# EAGLE design SparkFun_Qwiic_ADXL313 (EAGLE 9.6.2)
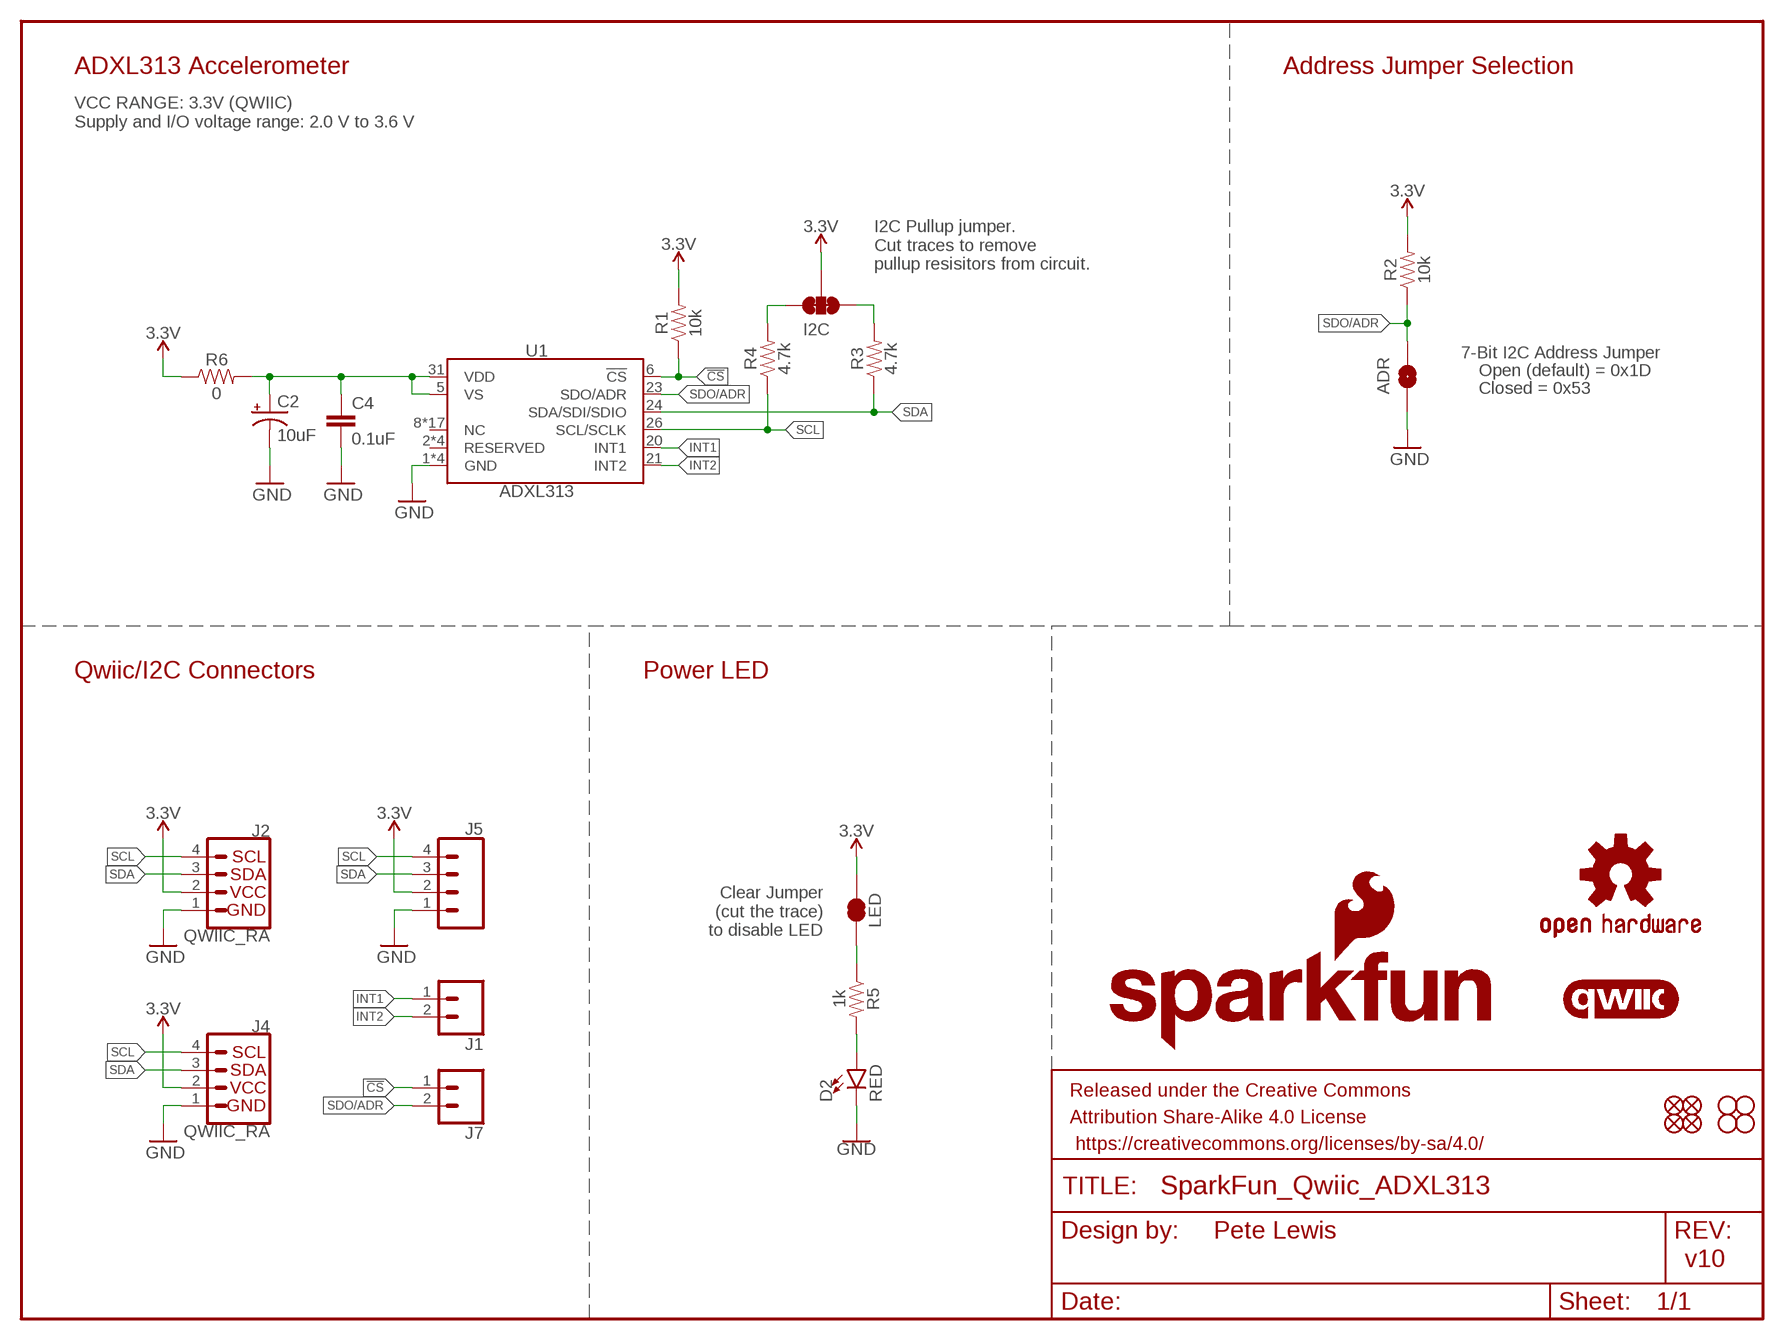
[diagram p0: schematic, sheet 1]

## Parts
ADR  JUMPER-SMT_2_NO_SILK  [SMT-JUMPER_2_NO_SILK]
C2  10uF  10UF-TANT  [EIA3216]
C4  0.1uF  0.1UF-0603-25V-(+80/-20%)  [0603]
D2  RED  LED-RED0603  [LED-0603]
FRAME1  FRAME-LETTER  [CREATIVE_COMMONS]
I2C  JUMPER-SMT_3_2-NC_TRACE_SILK  [SMT-JUMPER_3_2-NC_TRACE_SILK]
J1  CONN_021X02_NO_SILK  [1X02_NO_SILK]
J2  QWIIC_RA  QWIIC_CONNECTORJS-1MM  [JST04_1MM_RA]
J4  QWIIC_RA  QWIIC_CONNECTORJS-1MM  [JST04_1MM_RA]
J5  CONN_041X04_NO_SILK  [1X04_NO_SILK]
J7  CONN_021X02_NO_SILK  [1X02_NO_SILK]
JP1  LED  JUMPER-SMT_2_NC_TRACE_SILK  [SMT-JUMPER_2_NC_TRACE_SILK]
JP2  FIDUCIALUFIDUCIAL  [MICRO-FIDUCIAL]
JP3  STAND-OFF  [STAND-OFF]
JP4  STAND-OFF  [STAND-OFF]
JP5  FIDUCIALUFIDUCIAL  [MICRO-FIDUCIAL]
JP6  FIDUCIALUFIDUCIAL  [MICRO-FIDUCIAL]
JP8  STAND-OFF  [STAND-OFF]
JP9  STAND-OFF  [STAND-OFF]
JP11  FIDUCIALUFIDUCIAL  [MICRO-FIDUCIAL]
LOGO1  OSHW-LOGOMINI  [OSHW-LOGO-MINI]
LOGO2  SFE_LOGO_NAME_FLAME.1_INCH  [SFE_LOGO_NAME_FLAME_.1]
LOGO3  SFE_LOGO_FLAME.1_INCH  [SFE_LOGO_FLAME_.1]
LOGO4  QWIIC_LOGO_5MM  [QWIIC_5MM]
R1  10k  10KOHM-0603-1/10W-1%  [0603]
R2  10k  10KOHM-0603-1/10W-1%  [0603]
R3  4.7k  4.7KOHM-0603-1/10W-1%  [0603]
R4  4.7k  4.7KOHM-0603-1/10W-1%  [0603]
R5  1k  1KOHM-0603-1/10W-1%  [0603]
R6  0  0OHM-0603-1/10W  [0603]
U1  ADXL313  [LFCSP]

## Nets
3.3V: I2C.2 J2.2 J4.2 J5.2 JP1.2 R1.2 R2.2 R6.1
!CS: J7.1 R1.1 U1.6(!CS)
GND: ADR.1 C2.C(-) C4.2 D2.C J2.1 J4.1 J5.1 U1.1(GND) U1.3(GND) U1.4(GND) U1.EPAD(GND)
INT1: J1.1 U1.20(INT1)
INT2: J1.2 U1.21(INT2)
N$1: I2C.1 R3.2
N$2: I2C.3 R4.2
N$3: C2.A(+) C4.1 R6.2 U1.5(VS) U1.31(VDD)
N$6: D2.A R5.2
N$8: JP1.1 R5.1
SCL: J2.4 J4.4 J5.4 R4.1 U1.26(SCL/SCLK)
SDA: J2.3 J4.3 J5.3 R3.1 U1.24(SDA/SDI/SDIO)
SDO/ADR: ADR.2 J7.2 R2.1 U1.23(SDO/ADR)
Unconnected: U1.2(RESERVED) U1.7(RESERVED) U1.8(NC) U1.9(NC) U1.10(NC) U1.11(NC) U1.12(NC) U1.13(NC) U1.14(NC) U1.15(NC) U1.16(NC) U1.17(NC) U1.18(NC) U1.19(NC) U1.22(RESERVED) U1.25(NC) U1.27(NC) U1.28(NC) U1.29(NC) U1.30(NC) U1.32(RESERVED)

## Notes on the sheet
- ADXL313 Accelerometer | Address Jumper Selection
- VCC RANGE: 3.3V (QWIIC)
  Supply and I/O voltage range: 2.0 V to 3.6 V
- I2C Pullup jumper. 
  Cut traces to remove
  pullup resisitors from circuit.
- 7-Bit I2C Address Jumper
- Open (default) = 0x1D
- Closed = 0x53
- Qwiic/I2C Connectors | Power LED
- Clear Jumper
  (cut the trace)
  to disable LED
- Pete Lewis
- v10

## Library data of the parts
ADR = SparkFun-Jumpers:JUMPER-SMT_2_NO: Normally open jumper This jumper has two pads in close proximity to each other. Apply solder to close the connection. Round pads are easier to solder for beginners, but are a lot larger. SparkFun Product that uses the round pads: SparkFun EL Sequencer <https://www.sparkfun.com/products/12781>
C2 = SparkFun-Retired:10UF-TANT: 10uF Tantalum SMT CAP-00811- 16V 10% (EIA-3216); PROD_ID: CAP-00811
C4 = SparkFun-Capacitors:0.1UF: 0.1µF ceramic capacitors A capacitor is a passive two-terminal electrical component used to store electrical energy temporarily in an electric field.; PROD_ID: CAP-00810
D2 = SparkFun-LED:LED-RED: Red SMD LED Used in manufacturing of most products at SparkFun Packages: 0603 - SMD 0603 package [Product Link] <http://docs.avagotech.com/docs/AV02-0551EN> 0603 SMART - SMD 0603 SMART package ( more efficient and expensive)[Product Link] <http://www.osram-os.com/Graphics/XPic2/00077099_0.pdf> 1206 - SMD1206 package [Product Link] <https://www.sparkfun.com/datasheets/DevTools/LilyPad/Q150OVS4.pdff> SparkFun Products: Pro Mini 328 -5V <https://www.sparkfun.com/products/821> RedBoard <https://www.sparkfun.com/products/12757> IOIO-OTG <https://www.sparkfun.com/products/13613>; PROD_ID: DIO-00819
FRAME1 = SparkFun-Aesthetics:FRAME-LETTER: Schematic Frame - Letter Standard 8.5x11 US Letter frame
I2C = SparkFun-Jumpers:JUMPER-SMT_3_2-NC_TRACE: Normally closed trace jumper (2 of 2 connections) This jumper has a trace between all three pads so they are normally closed (NC). Use a razor knife to open the connection(s). For best results follow the IPC guidelines for cutting traces: Cutout at least 0.063 mm (0.005 in). Remove all loose material to clean up the cut area. Seal the cut with an approved epoxy. Reapply solder to reclose the connection(s).
J1 J7 = SparkFun-Connectors:CONN_02: Multi connection point. Often used as Generic Header-pin footprint for 0.1 inch spaced/style header connections On any of the 0.1 inch spaced packages, you can populate with these: Break Away Headers - Straight <https://www.sparkfun.com/products/116> (PRT-00116) Break Away Male Headers - Right Angle <https://www.sparkfun.com/products/553> (PRT-00553) Female Headers <https://www.sparkfun.com/products/115> (PRT-00115) Break Away Headers - Machine Pin <https://www.sparkfun.com/products/117> (PRT-00117) Break Away Female Headers - Swiss Machine Pin <https://www.sparkfun.com/products/743> (PRT-00743) For SCREWTERMINALS and SPRING TERMINALS visit here: Screw Terimnals on SparkFun.com <https://www.sparkfun.com/search/results?term=Screw+Terminals> (5mm/3.5mm/2.54mm spacing) This device is also useful as a general connection point to wire up your design to another part of your project. Our various solder wires solder well into these plated through hole pads. Hook-Up Wire - Assortment (Stranded, 22 AWG) <https://www.sparkfun.com/products/11375> (PRT-11375) Hook-Up Wire - Assortment (Solid Core, 22 AWG) <https://www.sparkfun.com/products/11367> (PRT-11367) View the entire wire category on our website here <https://www.sparkfun.com/categories/141> Special notes: Molex polarized connector foot print use with: PRT-08233 with associated crimp pins and housings. 2.54_SCREWTERM for use with PRT-10571. 3.5mm Screw Terminal footprints for PRT-08084 5mm Screw Terminal footprints for use with PRT-08432
J2 J4 = SparkFun-Connectors:QWIIC_CONNECTOR: SparkFun I2C Standard Qwiic Connector An SMD 1mm pitch JST connector makes it easy and quick (get it? Qwiic?) to connect I2C devices to each other. The Qwiic system <http://www.sparkfun.com/qwiic> enables fast and solderless connection between popular platforms and various sensors and actuators. We carry 200mm <https://www.sparkfun.com/products/14204>, 100mm <https://www.sparkfun.com/products/14205>, 50mm <https://www.sparkfun.com/products/14206>, and breadboard friendly <https://www.sparkfun.com/products/14207> Qwiic cables. We also offer 10 pcs strips <https://www.sparkfun.com/products/14323> the SMD connectors.; PROD_ID: CONN-13694; VALUE: QWIIC_RIGHT_ANGLE
J5 = SparkFun-Connectors:CONN_04: Multi connection point. Often used as Generic Header-pin footprint for 0.1 inch spaced/style header connections On any of the 0.1 inch spaced packages, you can populate with these: Break Away Headers - Straight <https://www.sparkfun.com/products/116> (PRT-00116) Break Away Male Headers - Right Angle <https://www.sparkfun.com/products/553> (PRT-00553) Female Headers <https://www.sparkfun.com/products/115> (PRT-00115) Break Away Headers - Machine Pin <https://www.sparkfun.com/products/117> (PRT-00117) Break Away Female Headers - Swiss Machine Pin <https://www.sparkfun.com/products/743> (PRT-00743) For SCREWTERMINALS and SPRING TERMINALS visit here: Screw Terimnals on SparkFun.com <https://www.sparkfun.com/search/results?term=Screw+Terminals> (5mm/3.5mm/2.54mm spacing) This device is also useful as a general connection point to wire up your design to another part of your project. Our various solder wires solder well into these plated through hole pads. Hook-Up Wire - Assortment (Stranded, 22 AWG) <https://www.sparkfun.com/products/11375> (PRT-11375) Hook-Up Wire - Assortment (Solid Core, 22 AWG) <https://www.sparkfun.com/products/11367> (PRT-11367) View the entire wire category on our website here <https://www.sparkfun.com/categories/141> Special notes: Molex polarized connector foot print use with SKU : PRT-08231 with associated crimp pins and housings. 1MM SMD Version SKU: PRT-10208; PROD_ID: CONN-09696
JP1 = SparkFun-Jumpers:JUMPER-SMT_2_NC_TRACE: Normally closed trace jumper This jumper has a trace between two pads so it's normally closed (NC). Use a razor knife to open the connection. For best results follow the IPC guidelines for cutting traces: Cutout at least 0.063 mm (0.005 in). Remove all loose material to clean up the cut area. Seal the cut with an approved epoxy. Reapply solder to reclose the connection.
JP2 JP5 JP6 JP11 = SparkFun:FIDUCIAL: Fiducial Alignment Points Various fiducial points for machine vision alignment.
JP3 JP4 JP8 JP9 = SparkFun:STAND-OFF: Stand Off This is the mechanical footprint for a #4 phillips button head screw. Use the keepout ring to avoid running the screw head into surrounding components. SKU : PRT-00447
LOGO1 = SparkFun-Aesthetics:OSHW-LOGO: Open-Source Hardware (OSHW) Logo This logo indicates the piece of hardware it is found on incorporates a OSHW license and/or adheres to the definition of open source hardware found here: http://freedomdefined.org/OSHW
LOGO2 = SparkFun-Aesthetics:SFE_LOGO_NAME_FLAME: SparkFun Font Logo w/ Flame This is the SparkFun full logo. The logo on the schematic will always be the same size; the package variant is the height of the flame part of the logo. Default layer for the logo on the board is tSilk.
LOGO3 = SparkFun-Aesthetics:SFE_LOGO_FLAME: SparkFun Flame Logo This is the SparkFun flame logo. The logo on the schematic will always be the same size; the package variant is the height of the flame. Default layer for the logo on the board is tSilk.
LOGO4 = SparkFun-Aesthetics:QWIIC_LOGO: Qwiic Logos for placement on schematic and PCB. The 5.5mm silk logo is best for placing next to Qwiic connector.
R1 R2 = SparkFun-Resistors:10KOHM: 10kΩ resistor A resistor is a passive two-terminal electrical component that implements electrical resistance as a circuit element. Resistors act to reduce current flow, and, at the same time, act to lower voltage levels within circuits. - Wikipedia; PROD_ID: RES-00824
R3 R4 = SparkFun-Resistors:4.7KOHM: 4.7kΩ resistor A resistor is a passive two-terminal electrical component that implements electrical resistance as a circuit element. Resistors act to reduce current flow, and, at the same time, act to lower voltage levels within circuits. - Wikipedia; PROD_ID: RES-07857
R5 = SparkFun-Resistors:1KOHM: 1kΩ resistor A resistor is a passive two-terminal electrical component that implements electrical resistance as a circuit element. Resistors act to reduce current flow, and, at the same time, act to lower voltage levels within circuits. - Wikipedia; PROD_ID: RES-07856
R6 = SparkFun-Resistors:0OHM: 0Ω resistor A resistor is a passive two-terminal electrical component that implements electrical resistance as a circuit element. Resistors act to reduce current flow, and, at the same time, act to lower voltage levels within circuits. - Wikipedia; PROD_ID: RES-08609
U1 = SparkFun-Sensors:ADXL313: Analog Devices ADXL313 3-Axis SPI/I2C 0.5/1/2/4g Ultra Low Power Accelerometer The ADXL313 is a small, thin, low power, 3-axis accelerometer with high resolution (13-bit) measurement up to ±4 g. Digital output data is formatted as 16-bit twos complement and is accessible through either a serial port interface (SPI) (3-wire or 4-wire) or I2C digital interface. Datasheet <https://www.analog.com/media/en/technical-documentation/data-sheets/ADXL313.pdf> SparkFun Products SparkFun Triple Axis Accelerometer Breakout - ADXL313 (QWIIC) <https://www.sparkfun.com/products/9836> (SEN-17241); PROD_ID: IC-15318

## Board
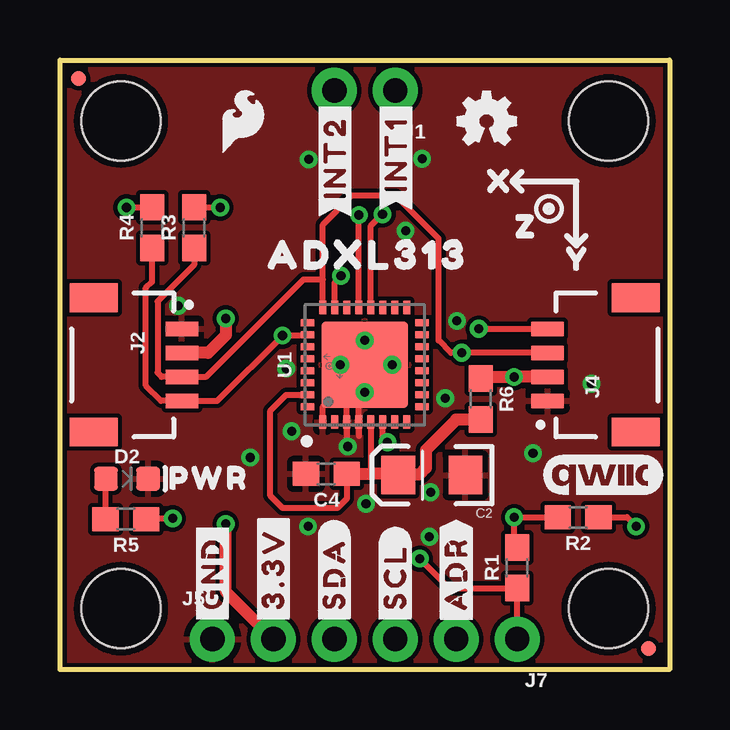
[diagram p1: board, top side]
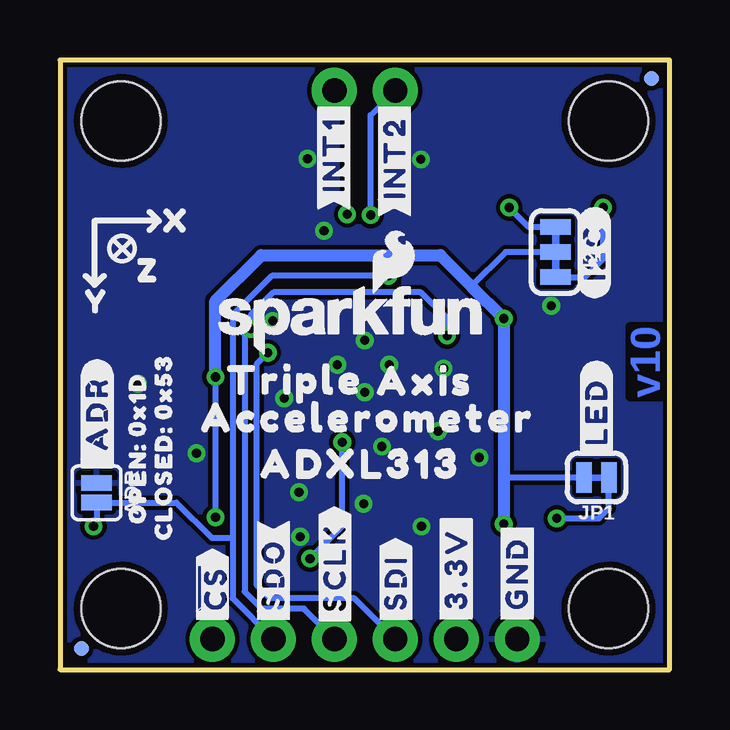
[diagram p2: board, bottom side, seen from below]

Size 25.4 x 25.4 mm. Coordinates in mm from the lower left corner, seen from the top.
Outline: 0,0 0,25.4 25.4,25.4 25.4,0 0,0
Copper layers (1*16): Top 0.035mm / dielectric 1.5mm / Bottom 0.035mm
Design rules "SparkFun-2-layer-TIGHT": minimum track width 7mil, minimum drill 15mil, track to track 7mil, track to pad 7mil, pad to pad 7mil, via to via 7mil, smd to smd 7mil, copper to edge 7mil, drill to drill 7mil, minimum pad ring 7mil, minimum via ring 7mil, stop-mask expansion 4mil, vias tented up to drill 25mil, thermal gap 10mil
tRestrict: area 12.2,10.3 to 12.2,10.4; area 10.5,10.2 to 10.6,10.4; area 12.6,10.9 to 12.8,10.9; area 14.5,12.6 to 14.5,12.8; area 12.6,14.5 to 12.8,14.5; area 10.9,12.6 to 10.9,12.8

### Footprints (pad centres in the part's own frame; a part is rotated, then mirrored left to right if it is on the bottom)
SMT-JUMPER_2_NO_SILK = smd 0.635 x 1.27: 1 -0.406,0; 2 0.406,0
EIA3216 = smd 1.4 x 1.6: A 1.4,0; C -1.4,0
0603 = smd 1.1 x 1: 1 -0.85,0; 2 0.85,0
LED-0603 = smd 1 x 1: A -0.877,0; C 0.877,0
SMT-JUMPER_3_2-NC_TRACE_SILK = smd 0.66 x 1.27: 1 -1.041,0; 2 0,0; 3 1.041,0
1X02_NO_SILK = drill 1.016 pad 1.88: 1 0,0; 2 2.54,0
JST04_1MM_RA = smd 0.6 x 1.35: 1 -1.5,0; 2 -0.5,0; 3 0.5,0; 4 1.5,0 | smd 1.2 x 2: NC1 2.8,-3.675; NC2 -2.8,-3.675
1X04_NO_SILK = drill 1.016 pad 1.88: 1 0,0; 2 2.54,0; 3 5.08,0; 4 7.62,0
SMT-JUMPER_2_NC_TRACE_SILK = smd 0.66 x 1.27: 1 -0.521,0; 2 0.521,0
MICRO-FIDUCIAL = smd 0.635 x 0.635: 1 0,0
STAND-OFF = hole 3.302: 0,0
LFCSP = smd 0.57 x 0.3: 1 -2.385,1.75; 2 -2.385,1.25; 3 -2.385,0.75; 4 -2.385,0.25; 5 -2.385,-0.25; 6 -2.385,-0.75; 7 -2.385,-1.25; 8 -2.385,-1.75; 17 2.385,-1.75; 18 2.385,-1.25; 19 2.385,-0.75; 20 2.385,-0.25; 21 2.385,0.25; 22 2.385,0.75; 23 2.385,1.25; 24 2.385,1.75 | smd 0.3 x 0.57: 9 -1.75,-2.385; 10 -1.25,-2.385; 11 -0.75,-2.385; 12 -0.25,-2.385; 13 0.25,-2.385; 14 0.75,-2.385; 15 1.25,-2.385; 16 1.75,-2.385; 25 1.75,2.385; 26 1.25,2.385; 27 0.75,2.385; 28 0.25,2.385; 29 -0.25,2.385; 30 -0.75,2.385; 31 -1.25,2.385; 32 -1.75,2.385 | smd 3.6 x 3.6: EPAD 0,0

### Placement (x,y rotation side)
ADR  23.88,7.37 270 bottom
C2  15.49,8.1 180 top
C4  11.1,8.15 180 top
D2  2.79,7.95 0 top
FRAME1  -15.24,-7.62 0 top  (outside the outline)
I2C  4.75,17.4 270 bottom
J1  13.97,24.13 180 top
J2  5.08,12.7 270 top
J4  20.32,12.7 90 top
J5  6.35,1.27 0 top
J7  19.05,1.27 180 top
JP1  3.05,8 180 bottom
JP2  24.51,0.89 0 top
JP3  2.54,22.86 0 top
JP4  22.86,22.86 0 top
JP5  0.76,24.64 0 bottom
JP6  0.76,24.64 0 top
JP8  2.54,2.54 0 top
JP9  22.86,2.54 0 top
JP11  24.51,0.89 0 bottom
LOGO1  17.78,22.86 0 top
LOGO2  13.23,14.58 0 bottom
LOGO3  7.62,22.86 0 top
LOGO4  22.61,8.13 0 top
R1  19.05,4.24 90 top
R2  21.59,6.35 180 top
R3  5.59,18.41 90 top
R4  3.84,18.41 90 top
R5  2.74,6.27 180 top
R6  17.53,11.28 270 top
U1  12.7,12.7 90 top
U$1  [TRIPLE0]  15.6,12.06 0 bottom
U$2  [AXIS0]  10.19,12.01 0 bottom
U$3  [ACCELEROMETER0]  12.57,10.49 0 bottom
U$4  [ADXL3130]  12.88,8.56 0 bottom
U$5  [#GND#0]  6.35,1.78 90 top
U$6  [#GND#0]  6.35,1.78 90 bottom
U$7  [#3#3V#0]  8.89,1.78 90 top
U$8  [#3#3V#0]  8.89,1.78 90 bottom
U$9  [#SDA#0]  11.43,1.78 90 top
U$10  [#SDI#0]  11.4,1.75 90 bottom
U$11  [#SCL#0]  13.97,1.78 90 top
U$12  [#_ADR#0]  23.85,8.08 90 bottom
U$13  [#INT2#0]  11.46,23.77 90 top
U$14  [#INT2#0]  11.46,23.77 90 bottom
U$15  [#INT1#0]  14,23.77 90 top
U$16  [#INT1#0]  14,23.77 90 bottom
U$17  [X0]  20.55,18.69 0 bottom
U$18  [##CS##0]  19.05,1.75 90 bottom
U$19  [ADXL3130]  12.83,17.27 0 top
U$20  [#SCLK#0]  13.94,1.7 90 bottom
U$21  [X0]  18.34,20.35 0 top
U$22  [OPEN#_0X1D0]  22.17,9.22 90 bottom
U$23  [CLOSED#_0X530]  21.08,9.27 90 bottom
U$24  [#LED#0]  3.05,8.64 90 bottom
U$25  [PWR0]  6.2,7.98 0 top
U$26  [Y0]  23.85,15.34 0 bottom
U$27  [#I2C#0]  3.12,19.25 90 bottom
U$28  [#ADR#0]  16.51,1.75 90 top
U$29  [Y0]  21.59,17.12 0 top
U$30  [#SDO#0]  16.51,1.75 90 bottom
U$31  [Z0]  21.72,16.64 0 bottom
U$32  [Z0]  19.43,18.47 0 top

### Tracks (layer width: path | path; a pad name or v marks a point on that pad's centre or on a via)
3.3V  (via drill 0.38)
  Top 0.254: R2.2 v18.92,6.35 18.92,5.22 R1.2
  Top 0.508: J4.2 18.93,12.2 | 18.93,12.2 v18.92,12.19 | J2.2 6.17,13.2 6.91,13.94 v6.91,14.63 | R6.1 17.6,12.2 18.93,12.2 | J5.2 6.91,3.25 v6.91,6.07
  Bottom 0.254: v18.92,12.19 v18.92,6.35 | 6.91,8.05 6.86,8 JP1.2 | I2C.2 6.83,17.4 8.26,15.98
  Bottom 0.508: v18.92,12.19 18.92,15.37 17.02,17.27 9.55,17.27 8.26,15.98 v6.91,14.63 6.91,8.05 v6.91,6.07
!CS  (via drill 0.38)
  Top 0.254: v13.64,9.47 13.45,9.66 U1.6 | v14.99,4.62 16.22,3.39 R1.1 J7.1
  Bottom 0.254: v14.99,4.62 13.64,5.97 v13.64,9.47
GND  (via drill 0.38)
  Top 0.254: 12.45,9.73 U1.4 12.45,11.31 v12.7,11.56 | 11.94,9.65 11.95,9.66 U1.3 11.95,11.19 11.79,11.35 | U1.1 10.95,10.95 11.12,11.12
  other vias: 11.99,9.3 9.65,9.93 13.84,12.7 12.7,13.72 11.68,12.7 10.36,21.26 15.09,21.29 22.15,11.91 4.93,15.16 15.44,7.39 12.75,6.91 10.34,5.97 7.92,8.84 9.42,12.55 16.54,14.53 16.05,11.3 14.4,18.29 15.39,5.54 19.71,9.02
  pour Bottom: 0,0 0,25.4 25.4,25.4 25.4,0
  pour Top: 0,0 0,25.4 25.4,25.4 25.4,0
INT1  (via drill 0.38)
  Top 0.254: U1.20 12.95,18.49 v13.44,18.97
  Bottom 0.254: J1.1 13.44,23.6 v13.44,18.97
INT2  (via drill 0.38)
  Top 0.254: U1.21 v12.45,18.94
  Bottom 0.254: v12.45,18.94 12.45,23.11 J1.2
N$1  (via drill 0.38)
  Top 0.254: v6.68,19.25 5.6,19.25 R3.2
  Bottom 0.254: I2C.1 5.87,18.44 v6.68,19.25
N$2  (via drill 0.38)
  Top 0.254: v2.77,19.25 2.78,19.27 R4.2
  Bottom 0.254: I2C.3 3.53,16.36 2.77,17.12 v2.77,19.25
N$3
  Top 0.254: U1.5 12.95,8.15 | C4.1 11.95,7.12 11.56,6.73 9.27,6.73 8.76,7.24 8.76,10.79 9.42,11.45 U1.31
  Top 0.508: R6.2 17.51,10.41 16.51,10.41 15.24,9.14 15.24,8.41 14.96,8.13 14.12,8.13 C2.A 14.04,8.15 12.95,8.15 C4.1
N$6
  Top 0.254: D2.A 1.89,7.93 R5.2
N$8  (via drill 0.38)
  Top 0.254: R5.1 3.62,6.3 v4.7,6.3
  Bottom 0.254: v4.7,6.3 2.95,6.3 2.53,6.72 JP1.1
SCL  (via drill 0.38)
  Top 0.254: U1.26 10.28,13.92 v9.27,13.92 6.55,11.2 J2.4 4.22,11.2 3.58,11.84 3.58,15.9 3.83,16.15 R4.1 | v17.45,14.2 J4.4
  Bottom 0.254: v9.27,13.92 9.27,14.63 10.36,15.72 16.51,15.72 17.45,14.78 v17.45,14.2 17.7,13.95 17.7,3.25 16.99,2.54 15.24,2.54 J5.4
SDA  (via drill 0.38)
  Top 0.254: 10.95,16.26 10.15,16.26 6.1,12.21 J2.3 4.23,12.2 4.06,12.37 4.06,15.34 5.59,16.87 R3.1 | J4.3 v16.74,13.2 16.29,13.2 15.77,13.72 15.77,17.96 13.99,19.74 12.14,19.74 10.95,18.55 10.95,16.26 | U1.24 10.95,16.26
  Bottom 0.254: J5.3 13.13,2.97 16.66,2.97 17.2,3.5 17.2,12.74 v16.74,13.2
SDO/ADR  (via drill 0.38)
  Top 0.254: R2.1 23.62,6.35 v24,5.97 | U1.23 11.45,16.15 v11.71,16.41
  Bottom 0.254: v24,5.97 23.88,6.1 ADR.2 20.55,6.96 19.07,5.49 18.21,5.49 | v11.71,16.41 16.59,16.41 18.21,14.78 18.21,5.49 | 18.21,5.49 18.21,2.97 J7.2

### Text on the board
Bottom: v10
tDocu: Pete Lewis